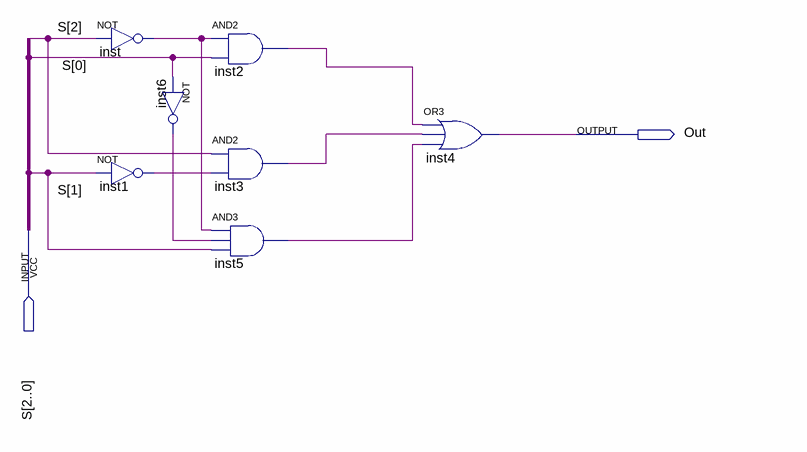
[diagram p0: schematic sheet]
// Quartus schematic sub_detector.bdf as structural Verilog: 7 symbols, 2 pins
module sub_detector (
  input  [2:0] S,
  output Out
);

  wire inst1_out, inst2_out, inst3_out, inst5_out, inst6_out, inst_out;

  not inst (inst_out, S[2]);
  not inst1 (inst1_out, S[1]);
  not inst6 (inst6_out, S[0]);
  and inst2 (inst2_out, inst_out, S[0]);
  and inst3 (inst3_out, S[2], inst1_out);
  and inst5 (inst5_out, inst_out, inst6_out, S[1]);
  or inst4 (Out, inst2_out, inst3_out, inst5_out);
endmodule
